# Altium schematic sheet STM32 Motherboard 2.SchDoc
size A4
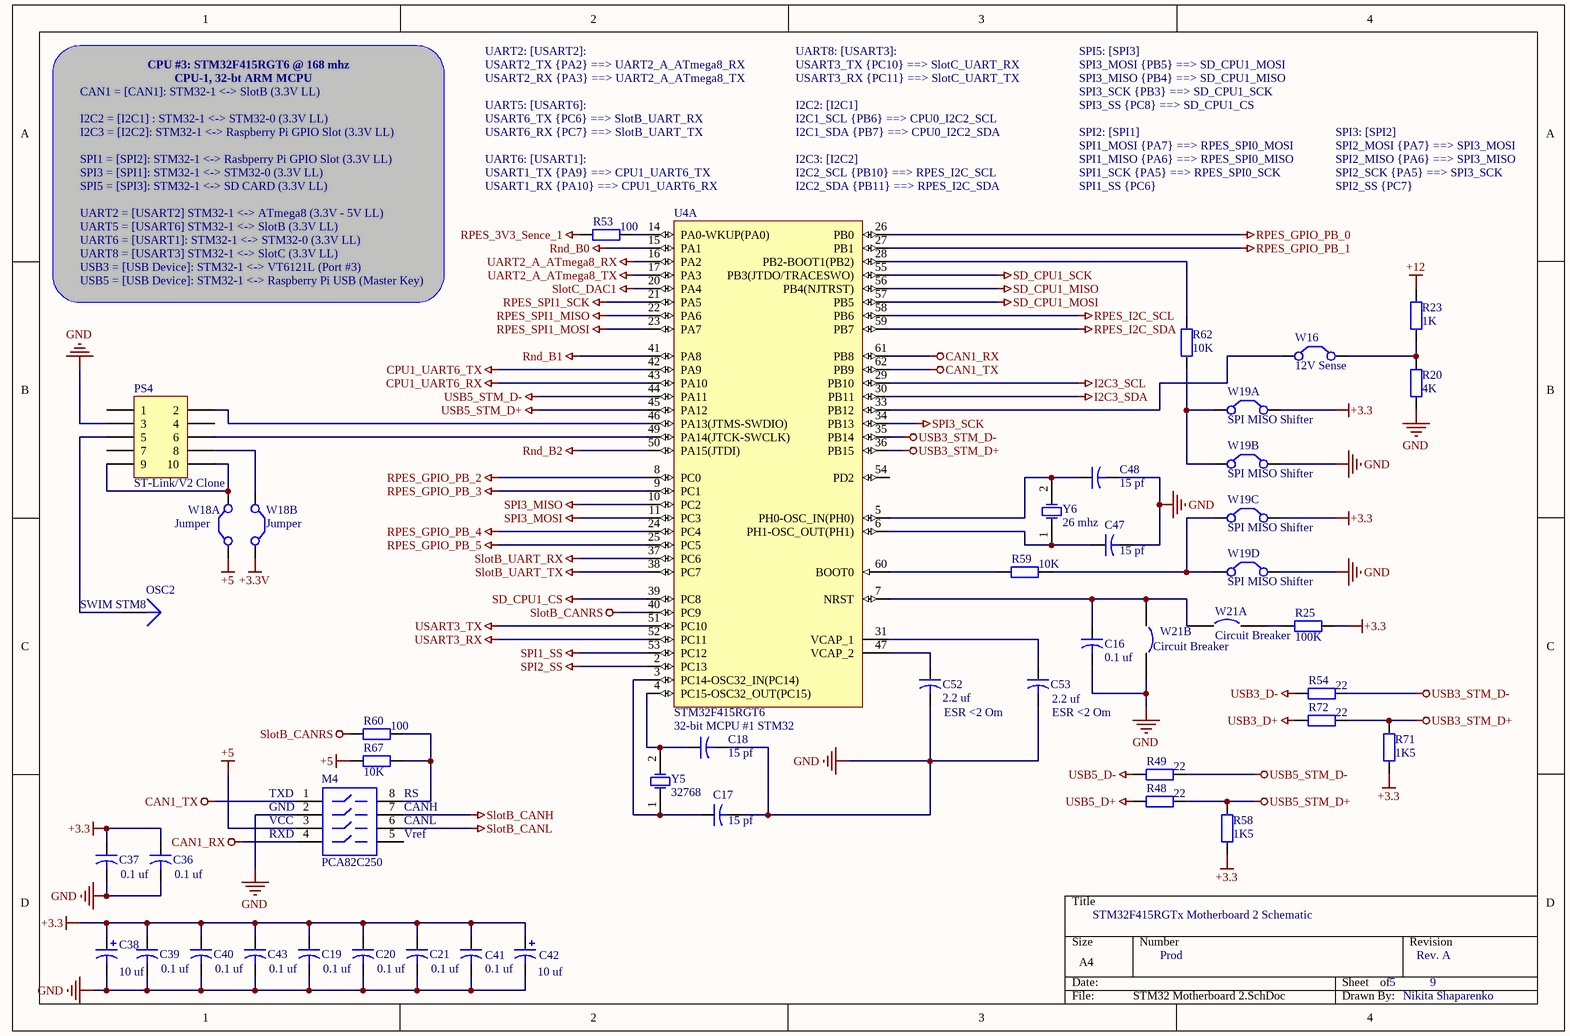
[diagram p0: STM32 Motherboard 2.SchDoc]

## Parts
C16  value 0.1 uf  [CAPR5-4X5]  (hidden comment: Cap2)
C17  value 15 pf  [CAPR5-4X5]  (hidden comment: Cap2)
C18  value 15 pf  [CAPR5-4X5]  (hidden comment: Cap2)
C19  value 0.1 uf  [CAPR5-4X5]  (hidden comment: Cap2)
C20  value 0.1 uf  [CAPR5-4X5]  (hidden comment: Cap2)
C21  value 0.1 uf  [CAPR5-4X5]  (hidden comment: Cap2)
C36  value 0.1 uf  [CAPR5-4X5]  (hidden comment: Cap2)
C37  value 0.1 uf  [CAPR5-4X5]  (hidden comment: Cap2)
C38  value 10 uf  [RAD-0.2]  (hidden comment: Cap Pol1)
C39  value 0.1 uf  [CAPR5-4X5]  (hidden comment: Cap2)
C40  value 0.1 uf  [CAPR5-4X5]  (hidden comment: Cap2)
C41  value 0.1 uf  [CAPR5-4X5]  (hidden comment: Cap2)
C42  value 10 uf  [RAD-0.2]  (hidden comment: Cap Pol1)
C43  value 0.1 uf  [CAPR5-4X5]  (hidden comment: Cap2)
C47  value 15 pf  [CAPR5-4X5]  (hidden comment: Cap2)
C48  value 15 pf  [CAPR5-4X5]  (hidden comment: Cap2)
C52  ESR <2 Om  value 2.2 uf  [CAPR5-4X5]
C53  ESR <2 Om  value 2.2 uf  [CAPR5-4X5]
M4  PCA82C250  [8S1_N]
OSC2  SWIM STM8  [PIN1]
PS4  ST-Link/V2 Clone  [HDR2X5]
R20  value 4K  [AXIAL-0.4]  (hidden comment: Res2)
R23  value 1K  [AXIAL-0.4]  (hidden comment: Res2)
R25  value 100K  [AXIAL-0.4]  (hidden comment: Res2)
R48  value 22  [AXIAL-0.4]  (hidden comment: Res2)
R49  value 22  [AXIAL-0.4]  (hidden comment: Res2)
R53  value 100  [AXIAL-0.4]  (hidden comment: Res2)
R54  value 22  [AXIAL-0.4]  (hidden comment: Res2)
R58  value 1K5  [AXIAL-0.4]  (hidden comment: Res2)
R59  value 10K  [AXIAL-0.4]  (hidden comment: Res2)
R60  value 100  [AXIAL-0.4]  (hidden comment: Res2)
R62  value 10K  [AXIAL-0.4]  (hidden comment: Res2)
R67  value 10K  [AXIAL-0.4]  (hidden comment: Res2)
R71  value 1K5  [AXIAL-0.4]  (hidden comment: Res2)
R72  value 22  [AXIAL-0.4]  (hidden comment: Res2)
U4  STM32F415RGT6  [STM-LQFP64_N]  (part A of 2)
W16  12V Sense  [RAD-0.1]
W18A  Jumper  [RAD-0.1]
W18B  Jumper  [RAD-0.1]
W19A  SPI MISO Shifter  [RAD-0.1]
W19B  SPI MISO Shifter  [RAD-0.1]
W19C  SPI MISO Shifter  [RAD-0.1]
W19D  SPI MISO Shifter  [RAD-0.1]
W21A  Circuit Breaker  [SPST-2]
W21B  Circuit Breaker  [SPST-2]
Y5  32768  [R38]
Y6  26 mhz  [R38]

## Nets
+3.3: C19.1 C20.1 C21.1 C36.1 C37.1 C38.1 C39.1 C40.1 C41.1 C42.1 C43.1 R25.1 R58.1 R71.1 W19A.2(C2) W19C.2(C2)
+3.3V: W18B.2(C2)
+5: M4.3 R67.2 W18A.1(C1)
+12: R23.2
CAN1_RX: M4.4 U4.61(PB8)
CAN1_TX: M4.1 U4.62(PB9)
CPU1_UART6_RX: U4.43(PA10)
CPU1_UART6_TX: U4.42(PA9)
GND: C16.2 C17.2 C18.2 C19.2 C20.2 C21.2 C36.2 C37.2 C38.2 C39.2 C40.2 C41.2 C42.2 C43.2 C47.2 C48.2 C52.2 C53.2 M4.2 PS4.3 R20.1 W19B.2(C2) W19D.2(C2) W21B.2
I2C3_SCL: U4.29(PB10)
I2C3_SDA: U4.30(PB11)
Rnd_B0: U4.15(PA1)
Rnd_B1: U4.41(PA8)
Rnd_B2: U4.50(PA15(JTDI))
RPES_3V3_Sence_1: R53.1
RPES_GPIO_PB_0: U4.26(PB0)
RPES_GPIO_PB_1: U4.27(PB1)
RPES_GPIO_PB_2: U4.8(PC0)
RPES_GPIO_PB_3: U4.9(PC1)
RPES_GPIO_PB_4: U4.24(PC4)
RPES_GPIO_PB_5: U4.25(PC5)
RPES_I2C_SCL: U4.58(PB6)
RPES_I2C_SDA: U4.59(PB7)
RPES_SPI1_MISO: U4.22(PA6)
RPES_SPI1_MOSI: U4.23(PA7)
RPES_SPI1_SCK: U4.21(PA5)
SD_CPU1_CS: U4.39(PC8)
SD_CPU1_MISO: U4.56(PB4(NJTRST))
SD_CPU1_MOSI: U4.57(PB5)
SD_CPU1_SCK: U4.55(PB3(JTDO/TRACESWO))
SlotB_CANH: M4.7
SlotB_CANL: M4.6
SlotB_CANRS: R60.1 U4.40(PC9)
SlotB_UART_RX: U4.37(PC6)
SlotB_UART_TX: U4.38(PC7)
SlotC_DAC1: U4.20(PA4)
SPI1_SS: U4.53(PC12)
SPI2_SS: U4.2(PC13)
SPI3_MISO: U4.10(PC2)
SPI3_MOSI: U4.11(PC3)
SPI3_SCK: U4.34(PB13)
UART2_A_ATmega8_RX: U4.16(PA2)
UART2_A_ATmega8_TX: U4.17(PA3)
USART3_RX: U4.52(PC11)
USART3_TX: U4.51(PC10)
USB3_D+: R72.1
USB3_D-: R54.1
USB3_STM_D+: R71.2 R72.2 U4.36(PB15)
USB3_STM_D-: R54.2 U4.35(PB14)
USB5_D+: R48.1
USB5_D-: R49.1
USB5_STM_D+: R48.2 R58.2 U4.45(PA12)
USB5_STM_D-: R49.2 U4.44(PA11)
NetC16_1: C16.1 U4.7(NRST) W21A.1 W21B.1
NetC17_1: C17.1 U4.3(PC14-OSC32_IN(PC14)) Y5.1(OSC1)
NetC18_1: C18.1 U4.4(PC15-OSC32_OUT(PC15)) Y5.2(OSC2)
NetC47_1: C47.1 U4.6(PH1-OSC_OUT(PH1)) Y6.1(OSC1)
NetC48_1: C48.1 U4.5(PH0-OSC_IN(PH0)) Y6.2(OSC2)
NetC52_1: C52.1 U4.47(VCAP_2)
NetC53_1: C53.1 U4.31(VCAP_1)
NetM4_8: M4.8 R60.2 R67.1
NetOSC2_1: OSC2.1 PS4.5
NetPS4_2: PS4.2 U4.46(PA13(JTMS-SWDIO))
NetPS4_6: PS4.6 U4.49(PA14(JTCK-SWCLK))
NetPS4_8: PS4.8 W18B.1(C1)
NetPS4_9: PS4.9 PS4.10 W18A.2(C2)
NetR20_2: R20.2 R23.1 W16.2(C2)
NetR25_2: R25.2 W21A.2
NetR53_2: R53.2 U4.14(PA0-WKUP(PA0))
NetR59_1: R59.1 U4.60(BOOT0)
NetR59_2: R59.2 W19C.1(C1) W19D.1(C1)
NetR62_1: R62.1 W19A.1(C1) W19B.1(C1)
NetR62_2: R62.2 U4.28(PB2-BOOT1(PB2))
NetU4_33: U4.33(PB12) W16.1(C1)

Not connected (* = marked no-connect by the designer): M4 5; PS4 1 4 7; U4 54(PD2)

## Notes on the sheet
- CAN1 = [CAN1]: STM32-1 <-> SlotB (3.3V LL)
- CPU #3: STM32F415RGT6 @ 168 mhz
- CPU-1, 32-bt ARM MCPU
- UART2: [USART2]:
- USART2_TX {PA2} ==> UART2_A_ATmega8_RX
- USART2_RX {PA3} ==> UART2_A_ATmega8_TX
- UART5: [USART6]:
- I2C2: [I2C1]
- UART8: [USART3]:
- USART3_TX {PC10} ==> SlotC_UART_RX
- USART3_RX {PC11} ==> SlotC_UART_TX
- SPI5: [SPI3]
- SPI3_SCK {PB3} ==> SD_CPU1_SCK
- SPI3_SS {PC8} ==> SD_CPU1_CS
- SPI3_MOSI {PB5} ==> SD_CPU1_MOSI
- SPI3_MISO {PB4} ==> SD_CPU1_MISO
- SPI1 = [SPI2]: STM32-1 <-> Rasbperry Pi GPIO Slot (3.3V LL)
- I2C2 = [I2C1] : STM32-1 <-> STM32-0 (3.3V LL)
- I2C3 = [I2C2]: STM32-1 <-> Raspberry Pi GPIO Slot (3.3V LL)
- SPI3 = [SPI1]: STM32-1 <-> STM32-0 (3.3V LL)
- USART6_TX {PC6} ==> SlotB_UART_RX
- USART6_RX {PC7} ==> SlotB_UART_TX
- UART6: [USART1]:
- USART1_TX {PA9} ==> CPU1_UART6_TX
- I2C3: [I2C2]
- I2C2_SCL {PB10} ==> RPES_I2C_SCL
- I2C1_SCL {PB6} ==> CPU0_I2C2_SCL
- I2C1_SDA {PB7} ==> CPU0_I2C2_SDA
- SPI2: [SPI1]
- SPI1_MOSI {PA7} ==> RPES_SPI0_MOSI
- SPI1_MISO {PA6} ==> RPES_SPI0_MISO
- SPI1_SCK {PA5} ==> RPES_SPI0_SCK
- SPI3: [SPI2]
- SPI2_MOSI {PA7} ==> SPI3_MOSI
- SPI2_MISO {PA6} ==> SPI3_MISO
- SPI2_SCK {PA5} ==> SPI3_SCK
- SPI5 = [SPI3]: STM32-1 <-> SD CARD (3.3V LL)
- UART5 = [USART6] STM32-1 <-> SlotB (3.3V LL)
- UART2 = [USART2] STM32-1 <-> ATmega8 (3.3V - 5V LL)
- UART6 = [USART1]: STM32-1 <-> STM32-0 (3.3V LL)
- USART1_RX {PA10} ==> CPU1_UART6_RX
- (near U4) I2C2_SDA {PB11} ==> RPES_I2C_SDA
- SPI1_SS {PC6}
- SPI2_SS {PC7}
- USB5 = [USB Device]: STM32-1 <-> Raspberry Pi USB (Master Key)
- USB3 = [USB Device]: STM32-1 <-> VT6121L (Port #3)
- UART8 = [USART3] STM32-1 <-> SlotC (3.3V LL)
- (near C18) 32-bit MCPU #1 STM32
- (near M4) TXD
- (near M4) GND
- (near M4) VCC
- (near M4) RXD
- RS
- CANH
- (near M4) CANL
- (near M4) Vref
- STM32F415RGTx Motherboard 2 Schematic
- Prod
- 5
- Rev. A
- 9
- Nikita Shaparenko

## Library data of the parts
C16-C21 C36 C37 C39-C41 C43 C47 C48 C52 C53 = Cap2: Capacitor; Published: 23-Sep-2002; PackageReference: CAPR5-4X5; Publisher: Altium Limited; PackageDescription: Capacitor; 2 Leads
C38 C42 = Cap Pol1: Polarized Capacitor (Radial); Published: 8-Jun-2000; LatestRevisionDate: 17-Jul-2002; LatestRevisionNote: Re-released for DXP Platform.; PackageReference: RB7.6-15; Publisher: Altium Limited; PackageDescription: Polarized Capacitor (Radial); 2 Leads
M4 = SW-DIP4: DIP Switch; Published: 24-Mar-1999; LatestRevisionDate: 17-Jul-2002; LatestRevisionNote: Re-released for DXP Platform.; PackageReference: DIP-8; Publisher: Altium Limited
OSC2 = Plug: LatestRevisionDate: 17-Jul-2002; LatestRevisionNote: Re-released for DXP Platform.; Publisher: Altium Limited
PS4 = Header 5X2: Header, 5-Pin, Dual row; LatestRevisionDate: 17-Jul-2002; LatestRevisionNote: Re-released for DXP Platform.; Publisher: Altium Limited
R20 R23 R25 R48 R49 R53 R54 R58-R60 R62 R67 R71 R72 = Res2: Resistor; Published: 8-Jun-2000; LatestRevisionDate: 17-Jul-2002; LatestRevisionNote: Re-released for DXP Platform.; PackageReference: AXIAL-0.4; Publisher: Altium Limited; PackageDescription: Axial Device, Thru-Hole; 2 Leads; 0.4 in Pin Spacing
U4 = STM32F415RGT6: ARM Cortex-M4 32-bit MCU+FPU, 210 DMIPS, 1024 kB Flash, 192 kB Internal RAM, 51 I/Os, 64-pin LQFP, -40 to 85 degC, Tray; Manufacturer: STMicroelectronics; D/A Converter: 2x12-bit; FLASH Size (Prog) (kB): 1024; I/Os (High Current): 51; Internal RAM Size (kB): 192; Operating Frequency(F) (Processor speed) (MHz): 168; Supply Voltage(Vcc) max (V): 3.6; Supply Voltage(Vcc) min (V): 1.8; DatasheetVersion: Rev. 4; PackageVersion: Rev. 4, 06/2013; PackageReference: LQFP64; PackageDescription: 64-Pin Low Profile Quad Flat Package, 10 x 10 mm Body, 0.5 mm Pitch; Supplier 1: Digi-Key; Supplier Part Number 1: 497-11907-ND; Supplier 2: Farnell; Supplier Part Number 2: 2064370; Supplier 3: Newark; Supplier Part Number 3: 73T2335; Supplier 4: Mouser; Supplier Part Number 4: 511-STM32F415RGT6; Core: ARM Cortex-M4; Packing: Tray; Mounting Technology: Surface Mount; PartNumber: STM32F415RGT6; ComponentLink1Description: Manufacturer URL; ComponentLink1URL: http://www.st.com/web/en/home.html; ComponentLink2Description: Datasheet; ComponentLink2URL: http://www.st.com/st-web-ui/static/active/en/resource/technical/document/datasheet/DM00035129.pdf; ComponentLink3Description: Package Specification; ComponentLink3URL: http://www.st.com/st-web-ui/static/active/en/resource/technical/document/datasheet/DM00037051.pdf
W16 W18A W18B W19A W19B W19C W19D = Jumper: Jumper Wire; Published: 24-Mar-1999; LatestRevisionDate: 17-Jul-2002; LatestRevisionNote: Re-released for DXP Platform.; PackageReference: RAD-0.2; Publisher: Altium Limited; PackageDescription: Radial Cap, Thru-Hole; 2 Leads; 0.2 in Pin Spacing
Y5 Y6 = XTAL: Crystal Oscillator; Published: 8-Jun-2000; LatestRevisionDate: 17-Jul-2002; LatestRevisionNote: Re-released for DXP Platform.; PackageReference: R38; Publisher: Altium Limited; PackageDescription: Crystal, Thru-Hole; 2 Leads; Body 3.1 x 8.2 mm (Dia.xH)
W21A W21B = Circuit Breaker: Published: 24-Mar-1999; LatestRevisionDate: 17-Jul-2002; LatestRevisionNote: Re-released for DXP Platform.; PackageReference: SPST-2; Publisher: Altium Limited; PackageDescription: Switch; 2 Leads